# EAGLE design FemtoRail (EAGLE 6.4)
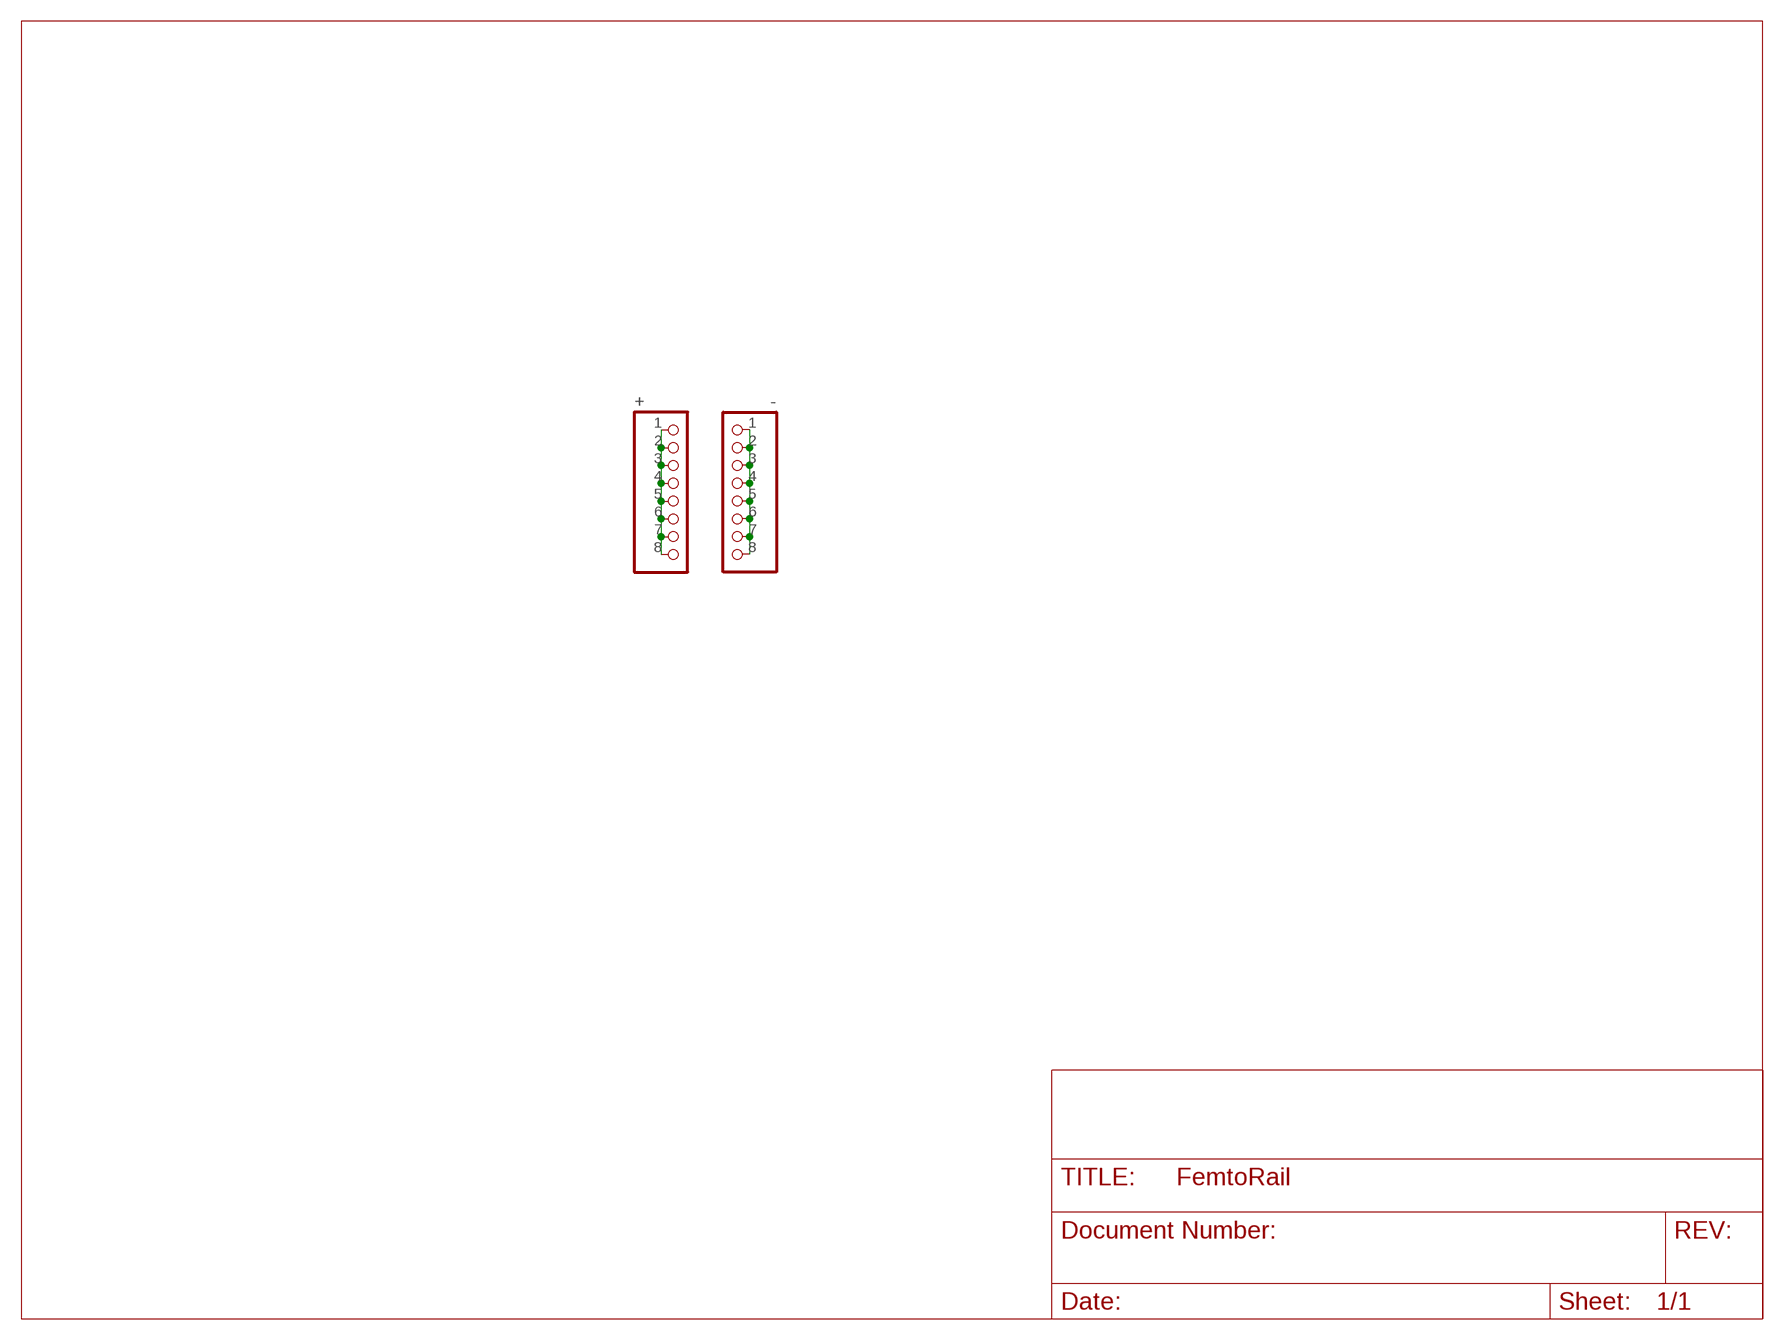
[diagram p0: schematic, sheet 1]

## Parts
+  PINHD-1X8  [1X08]
-  PINHD-1X8  [1X08]

## Nets
N$1: +.1 +.2 +.3 +.4 +.5 +.6 +.7 +.8
N$2: -.1 -.2 -.3 -.4 -.5 -.6 -.7 -.8

## Library data of the parts
+ - = pinhead:PINHD-1X8: PIN HEADER

## Board
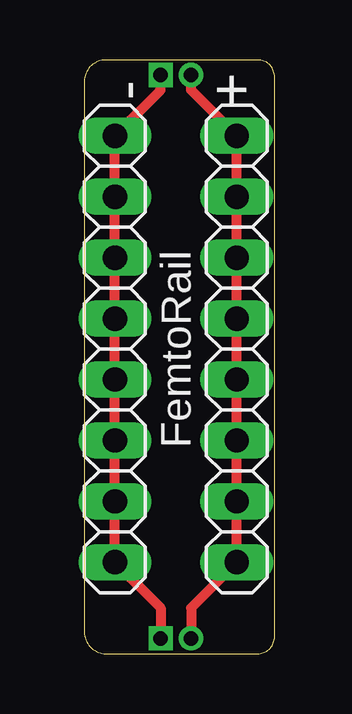
[diagram p1: board, top side]

Size 7.92 x 24.75 mm. Coordinates in mm from the lower left corner, seen from the top.
Outline: 0,23.86 0,0.9 arc90 0.9,0 7.22,0 arc90 7.92,0.7 7.92,24.06 arc90 7.23,24.75 0.89,24.75 arc90 0,23.86
Copper layers (1*16): Top 0.035mm / dielectric 1.5mm / Bottom 0.035mm
Design rules "default": minimum track width 10mil, minimum drill 24mil, track to track 8mil, track to pad 8mil, pad to pad 8mil, via to via 8mil, smd to smd 8mil, copper to edge 40mil, drill to drill 8mil, minimum pad ring 10mil, minimum via ring 8mil, stop-mask expansion 4mil, vias tented up to drill 0mil, thermal gap 10mil

### Footprints (pad centres in the part's own frame; a part is rotated, then mirrored left to right if it is on the bottom)
1X08 = drill 1.016 long: 1 -8.89,0; 2 -6.35,0; 3 -3.81,0; 4 -1.27,0; 5 1.27,0; 6 3.81,0; 7 6.35,0; 8 8.89,0

### Placement (x,y rotation side)
+  6.35,12.7 90 top
-  1.27,12.7 90 top

### Tracks (layer width: path | path; a pad name or v marks a point on that pad's centre or on a via)
N$1  (via drill 0.6)
  Top 0.406: v4.45,0.64 4.45,1.91 +.1 +.2 +.3 +.4 +.5 +.6 +.7 +.8 4.45,23.5 v4.45,24.13
N$2  (via drill 0.6)
  Top 0.406: v3.17,24.13 3.17,23.5 -.8 -.7 -.6 -.5 -.4 -.3 -.2 -.1 3.17,1.91 v3.17,0.64

### Text on the board
tNames: - | + | FemtoRail
bNames: Femtoduino.com | - | +